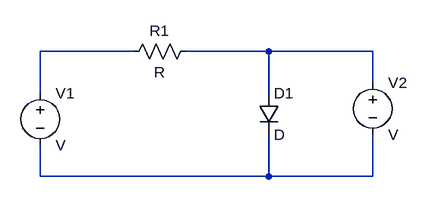
[diagram p0: schematic Lab1.asc]
Lab1.asc, the LTspice schematic file:
Version 4
SHEET 1 880 680
WIRE 160 48 16 48
WIRE 368 48 240 48
WIRE 528 48 368 48
WIRE 528 96 528 48
WIRE 16 112 16 48
WIRE 368 112 368 48
WIRE 16 240 16 192
WIRE 368 240 368 176
WIRE 368 240 16 240
WIRE 528 240 528 176
WIRE 528 240 368 240
SYMBOL voltage 16 96 R0
SYMATTR InstName V1
SYMBOL res 256 32 R90
WINDOW 0 0 56 VBottom 2
WINDOW 3 32 56 VTop 2
SYMATTR InstName R1
SYMBOL diode 352 112 R0
SYMATTR InstName D1
SYMBOL voltage 528 80 R0
SYMATTR InstName V2

The netlist it stands for:
* Lab1.asc
V1 N001 N003 V
R1 N002 N001 R
D1 N002 N003 D
V2 N002 N003 V
.model D D
.lib standard.dio
.backanno
.end